# Altium schematic sheet LED_Treiber.SchDoc
size A2
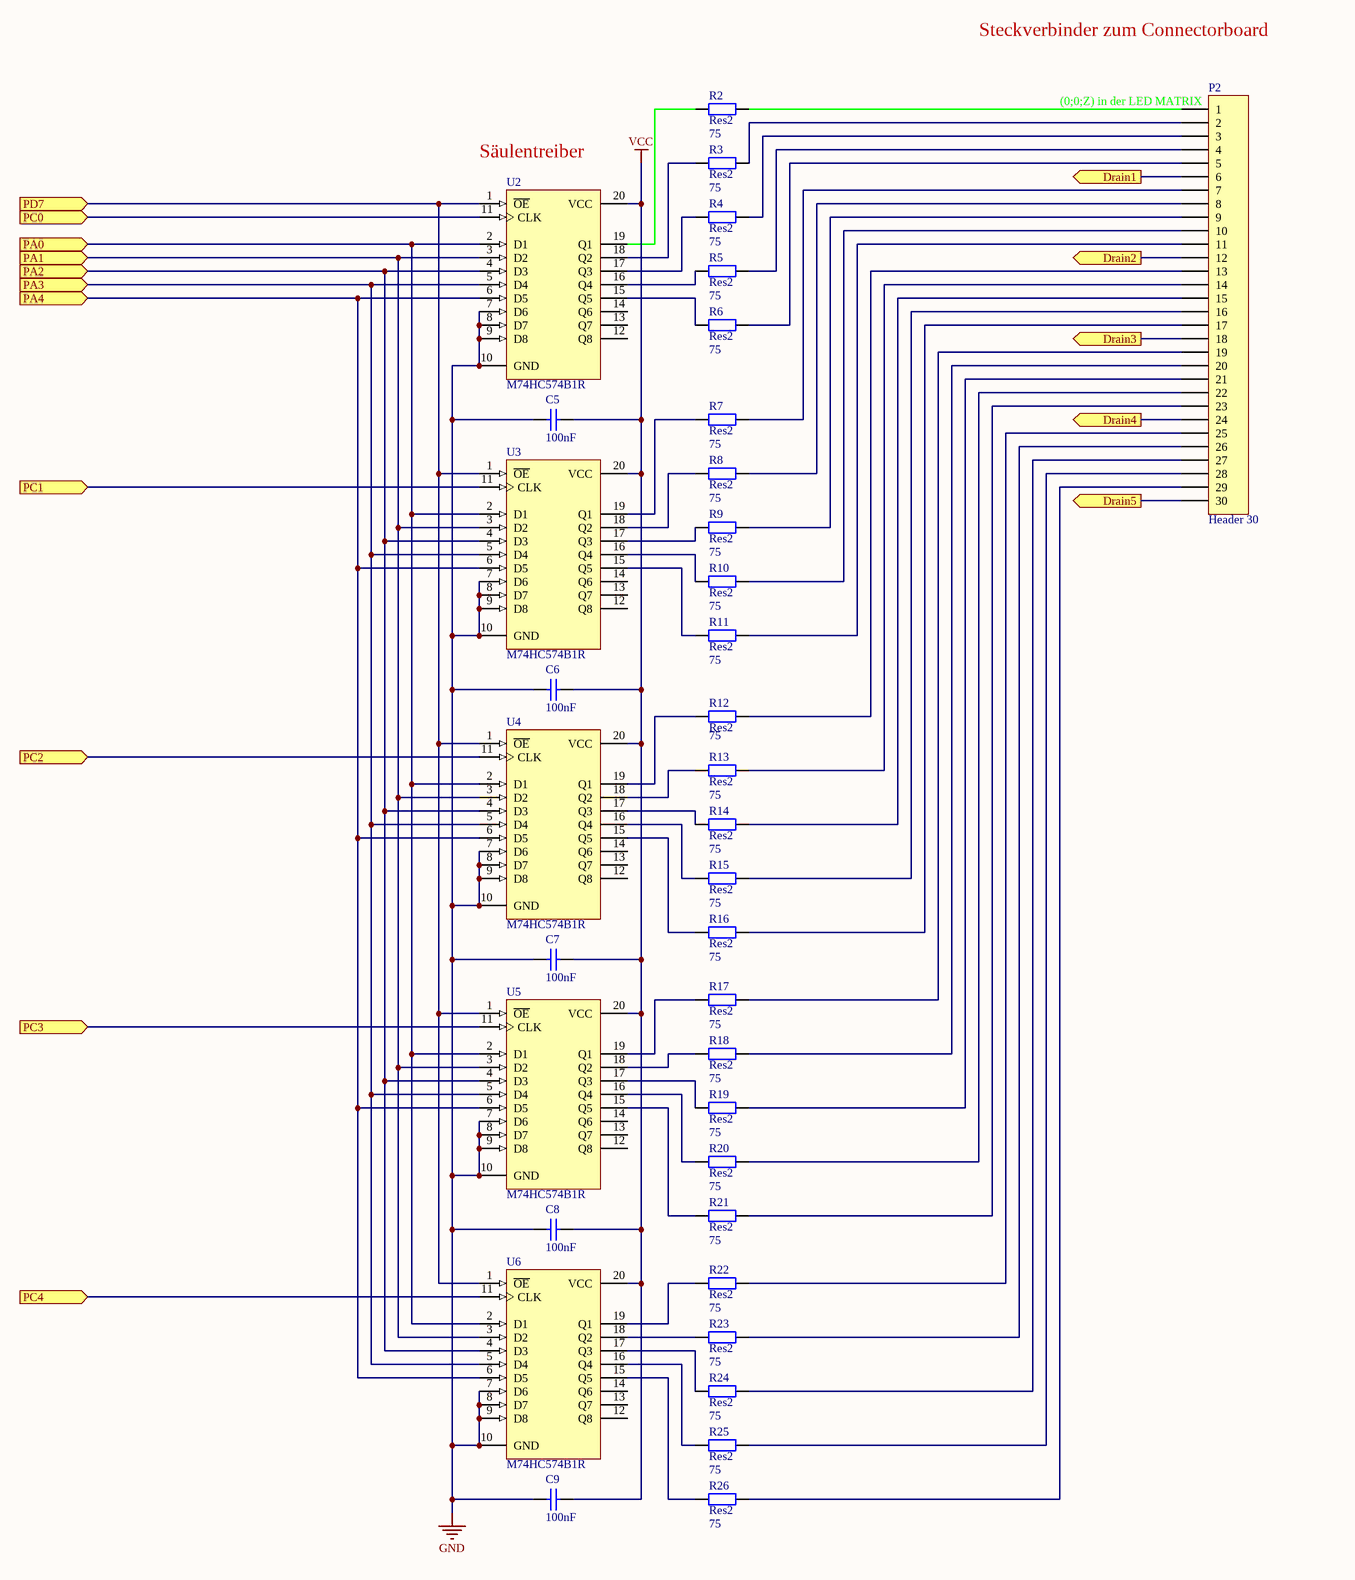
[diagram p0: LED_Treiber.SchDoc]

## Parts
C5  value 100nF  [R38]  (hidden comment: Cap)
C6  value 100nF  [R38]  (hidden comment: Cap)
C7  value 100nF  [R38]  (hidden comment: Cap)
C8  value 100nF  [R38]  (hidden comment: Cap)
C9  value 100nF  [R38]  (hidden comment: Cap)
P2  Header 30  [HDR1X30]
R2  Res2  value 75  [R38]
R3  Res2  value 75  [R38]
R4  Res2  value 75  [R38]
R5  Res2  value 75  [R38]
R6  Res2  value 75  [R38]
R7  Res2  value 75  [R38]
R8  Res2  value 75  [R38]
R9  Res2  value 75  [R38]
R10  Res2  value 75  [R38]
R11  Res2  value 75  [R38]
R12  Res2  value 75  [R38]
R13  Res2  value 75  [R38]
R14  Res2  value 75  [R38]
R15  Res2  value 75  [R38]
R16  Res2  value 75  [R38]
R17  Res2  value 75  [R38]
R18  Res2  value 75  [R38]
R19  Res2  value 75  [R38]
R20  Res2  value 75  [R38]
R21  Res2  value 75  [R38]
R22  Res2  value 75  [R38]
R23  Res2  value 75  [R38]
R24  Res2  value 75  [R38]
R25  Res2  value 75  [R38]
R26  Res2  value 75  [R38]
U2  M74HC574B1R  [DIP20]
U3  M74HC574B1R  [DIP20]
U4  M74HC574B1R  [DIP20]
U5  M74HC574B1R  [DIP20]
U6  M74HC574B1R  [DIP20]

## Ports
Drain1 (out), Drain2 (out), Drain3 (out), Drain4 (out), Drain5 (out), PA0 (in), PA1 (in), PA2 (in), PA3 (in), PA4 (in), PC0 (in), PC1 (in), PC2 (in), PC3 (in), PC4 (in), PD7 (in)

## Nets
GND: C5.1 C6.1 C7.1 C8.1 C9.1 U2.7(D6) U2.8(D7) U2.9(D8) U2.10(GND) U3.7(D6) U3.8(D7) U3.9(D8) U3.10(GND) U4.7(D6) U4.8(D7) U4.9(D8) U4.10(GND) U5.7(D6) U5.8(D7) U5.9(D8) U5.10(GND) U6.7(D6) U6.8(D7) U6.9(D8) U6.10(GND)
VCC: C5.2 C6.2 C7.2 C8.2 C9.2 U2.20(VCC) U3.20(VCC) U4.20(VCC) U5.20(VCC) U6.20(VCC)
Drain1: P2.6 ; port Drain1
Drain2: P2.12 ; port Drain2
Drain3: P2.18 ; port Drain3
Drain4: P2.24 ; port Drain4
Drain5: P2.30 ; port Drain5
PA0: U2.2(D1) U3.2(D1) U4.2(D1) U5.2(D1) U6.2(D1) ; port PA0
PA1: U2.3(D2) U3.3(D2) U4.3(D2) U5.3(D2) U6.3(D2) ; port PA1
PA2: U2.4(D3) U3.4(D3) U4.4(D3) U5.4(D3) U6.4(D3) ; port PA2
PA3: U2.5(D4) U3.5(D4) U4.5(D4) U5.5(D4) U6.5(D4) ; port PA3
PA4: U2.6(D5) U3.6(D5) U4.6(D5) U5.6(D5) U6.6(D5) ; port PA4
PC0: U2.11(CLK) ; port PC0
PC1: U3.11(CLK) ; port PC1
PC2: U4.11(CLK) ; port PC2
PC3: U5.11(CLK) ; port PC3
PC4: U6.11(CLK) ; port PC4
PD7: U2.1(~{OE}) U3.1(~{OE}) U4.1(~{OE}) U5.1(~{OE}) U6.1(~{OE}) ; port PD7
NetP2_1: P2.1 R2.2
NetP2_2: P2.2 R3.2
NetP2_3: P2.3 R4.2
NetP2_4: P2.4 R5.2
NetP2_5: P2.5 R6.2
NetP2_7: P2.7 R7.2
NetP2_8: P2.8 R8.2
NetP2_9: P2.9 R9.2
NetP2_10: P2.10 R10.2
NetP2_11: P2.11 R11.2
NetP2_13: P2.13 R12.2
NetP2_14: P2.14 R13.2
NetP2_15: P2.15 R14.2
NetP2_16: P2.16 R15.2
NetP2_17: P2.17 R16.2
NetP2_19: P2.19 R17.2
NetP2_20: P2.20 R18.2
NetP2_21: P2.21 R19.2
NetP2_22: P2.22 R20.2
NetP2_23: P2.23 R21.2
NetP2_25: P2.25 R22.2
NetP2_26: P2.26 R23.2
NetP2_27: P2.27 R24.2
NetP2_28: P2.28 R25.2
NetP2_29: P2.29 R26.2
NetR2_1: R2.1 U2.19(Q1)
NetR3_1: R3.1 U2.18(Q2)
NetR4_1: R4.1 U2.17(Q3)
NetR5_1: R5.1 U2.16(Q4)
NetR6_1: R6.1 U2.15(Q5)
NetR7_1: R7.1 U3.19(Q1)
NetR8_1: R8.1 U3.18(Q2)
NetR9_1: R9.1 U3.17(Q3)
NetR10_1: R10.1 U3.16(Q4)
NetR11_1: R11.1 U3.15(Q5)
NetR12_1: R12.1 U4.19(Q1)
NetR13_1: R13.1 U4.18(Q2)
NetR14_1: R14.1 U4.17(Q3)
NetR15_1: R15.1 U4.16(Q4)
NetR16_1: R16.1 U4.15(Q5)
NetR17_1: R17.1 U5.19(Q1)
NetR18_1: R18.1 U5.18(Q2)
NetR19_1: R19.1 U5.17(Q3)
NetR20_1: R20.1 U5.16(Q4)
NetR21_1: R21.1 U5.15(Q5)
NetR22_1: R22.1 U6.19(Q1)
NetR23_1: R23.1 U6.18(Q2)
NetR24_1: R24.1 U6.17(Q3)
NetR25_1: R25.1 U6.16(Q4)
NetR26_1: R26.1 U6.15(Q5)

Not connected (* = marked no-connect by the designer): U2 12(Q8) 13(Q7) 14(Q6); U3 12(Q8) 13(Q7) 14(Q6); U4 12(Q8) 13(Q7) 14(Q6); U5 12(Q8) 13(Q7) 14(Q6); U6 12(Q8) 13(Q7) 14(Q6)

## Notes on the sheet
- Steckverbinder zum Connectorboard
- (near P2) (0;0;Z) in der LED MATRIX
- (near U2) Säulentreiber

## Library data of the parts
C5-C9 = Cap: Capacitor; Published: 8-Jun-2000; LatestRevisionDate: 17-Jul-2002; LatestRevisionNote: Re-released for DXP Platform.; PackageReference: RAD-0.3; Publisher: Altium Limited; PackageDescription: Radial Cap, Thru-Hole; 2 Leads; 0.3 in Pin Spacing
P2 = Header 30: Header, 30-Pin; LatestRevisionDate: 17-Jul-2002; LatestRevisionNote: Re-released for DXP Platform.; Publisher: Altium Limited
R2-R26 = Res2: Resistor; Published: 8-Jun-2000; LatestRevisionDate: 17-Jul-2002; LatestRevisionNote: Re-released for DXP Platform.; PackageReference: AXIAL-0.4; Publisher: Altium Limited; PackageDescription: Axial Device, Thru-Hole; 2 Leads; 0.4 in Pin Spacing
U2-U6 = M74HC574B1R: Octal D-Type Flip-Flop with 3-State Output Non-Inverting; Published: 8-Jun-2000; LatestRevisionDate: 06-Jun-2005; LatestRevisionNote: Stylized 3D Model Added.; DatasheetVersion: Mar-1993; PackageVersion: Jun-1998; PackageReference: DIP20; Publisher: Altium Limited; PackageDescription: DIP; 20 Leads; Row Spacing 7.62 mm; Pitch 2.54 mm; Code_JEDEC: MS-015-AE; ComponentLink1Description: Manufacturer Link; ComponentLink1URL: http://www.st.com/; ComponentLink2Description: Datasheet; ComponentLink2URL: http://www.st.com/stonline/products/literature/ds/8025/m74hc574.pdf